# Altium schematic sheet Sheet_1_2026-02-17.schdoc
size 315 x 198 mm
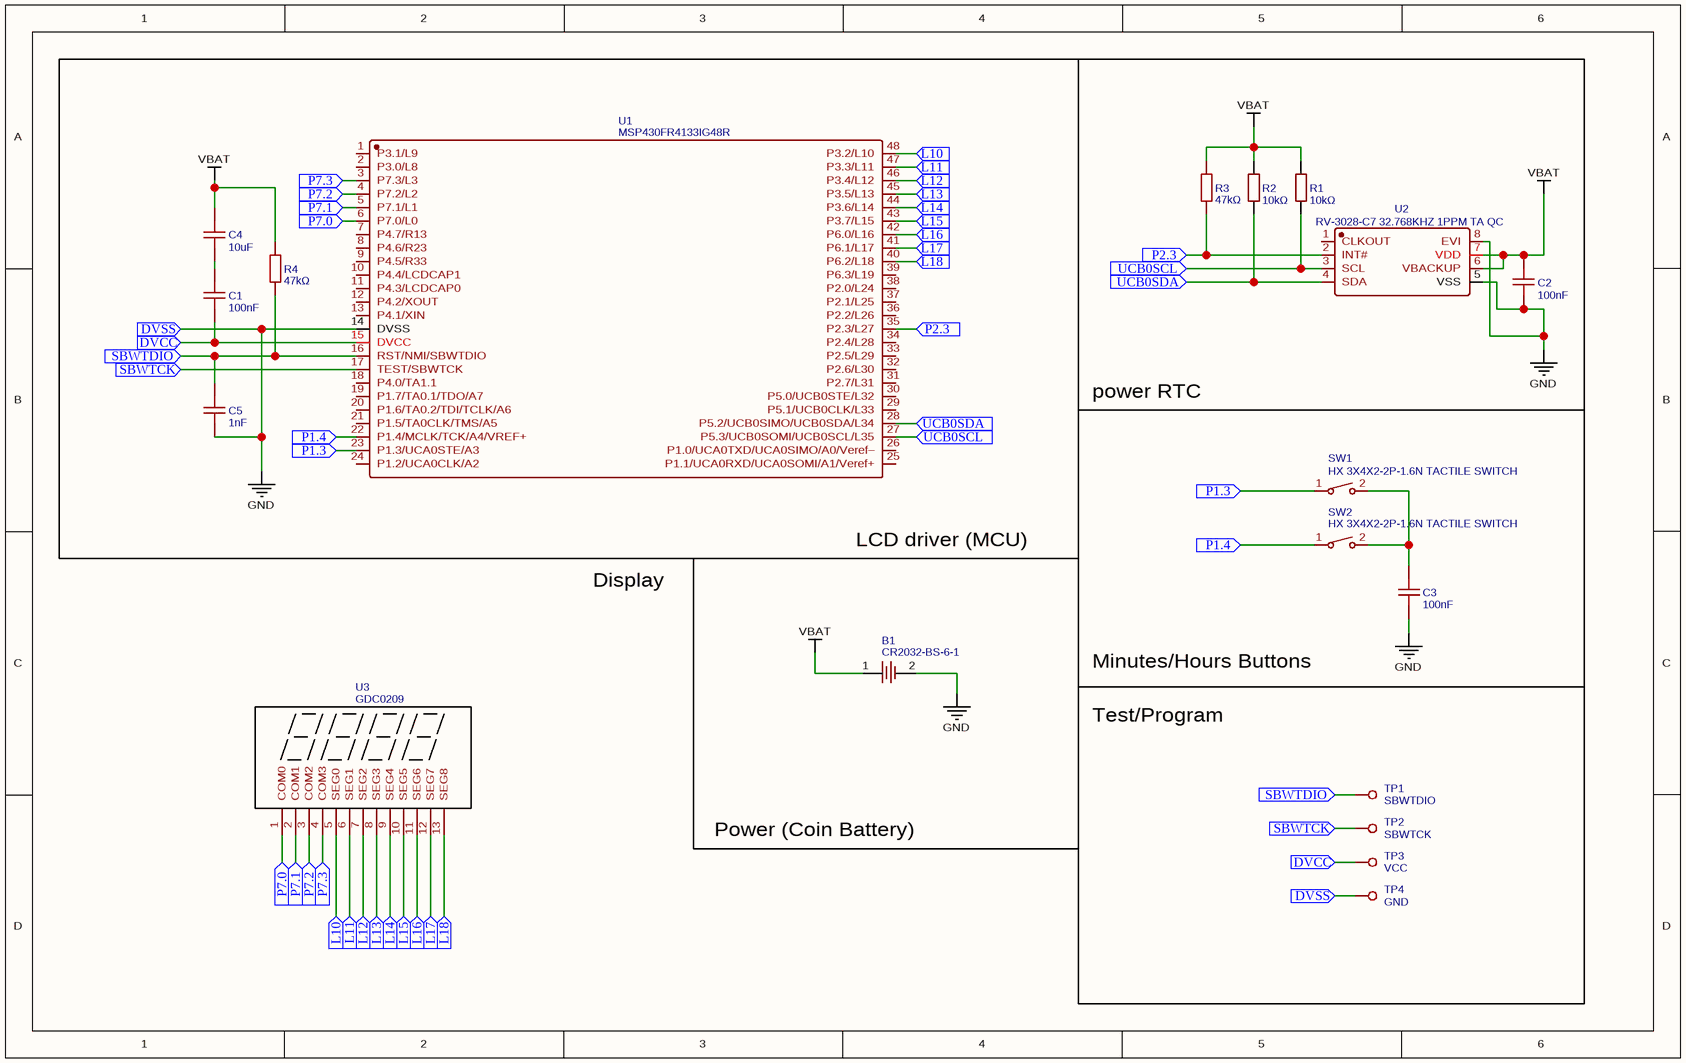
[diagram p0: Sheet_1_2026-02-17.schdoc]

## Parts
B1  CR2032-BS-6-1  [BAT-TH_CR2032-BS-6-1]
C1  100nF  [C0603]
C2  100nF  [C0603]
C3  100nF  [C0603]
C4  10uF  [C0805]
C5  1nF  [C0402]
R1  10kΩ  [R0603]
R2  10kΩ  [R0603]
R3  47kΩ  [R0603]
R4  47kΩ  [R0603]
SW1  HX 3X4X2-2P-1.6N TACTILE SWITCH  [KEY-SMD_L4.0-W3.0-LS4.9-1]
SW2  HX 3X4X2-2P-1.6N TACTILE SWITCH  [KEY-SMD_L4.0-W3.0-LS4.9-1]
TP1  SBWTDIO  [TESTPOINT:TESTPOINT_PAD_2.0X2.0MM]
TP2  SBWTCK  [TESTPOINT:TESTPOINT_PAD_2.0X2.0MM]
TP3  VCC  [TESTPOINT:TESTPOINT_PAD_2.0X2.0MM]
TP4  GND  [TESTPOINT:TESTPOINT_PAD_2.0X2.0MM]
U1  MSP430FR4133IG48R  [TSSOP-48_L12.5-W6.1-P0.50-LS8.1-BL]
U2  RV-3028-C7 32.768KHZ 1PPM TA QC  [OSC-SMD_8P-L3.2-W1.5-P0.90-BL]
U3  GDC0209  [GDC0209]

## Blocks framed on the sheet
LCD driver (MCU): C1 C4 C5 R4 U1
power RTC: C2 R1-R3 U2

## Ports
DVCC (in), DVSS (in), L10 (in), L11 (in), L12 (in), L13 (in), L14 (in), L15 (in), L16 (in), L17 (in), L18 (in), P1.3 (in), P1.4 (in), P2.3 (in), P7.0 (in), P7.1 (in), P7.2 (in), P7.3 (in), SBWTCK (in), SBWTDIO (in), UCB0SCL (in), UCB0SDA (in)

## Nets
GND: B1.2 C2.2 C3.2 C5.2 TP4.1 U1.14(DVSS) U2.5(VSS) U2.8(EVI) ; port DVSS
VBAT: B1.1 C2.1 C4.2 R1.1 R2.1 R3.1 R4.1 U2.6(VBACKUP) U2.7(VDD)
DVCC: C1.2 TP3.1 U1.15(DVCC) ; port DVCC
L10: U1.48(P3.2/L10) U3.5(SEG0) ; port L10
L11: U1.47(P3.3/L11) U3.6(SEG1) ; port L11
L12: U1.46(P3.4/L12) U3.7(SEG2) ; port L12
L13: U1.45(P3.5/L13) U3.8(SEG3) ; port L13
L14: U1.44(P3.6/L14) U3.9(SEG4) ; port L14
L15: U1.43(P3.7/L15) U3.10(SEG5) ; port L15
L16: U1.42(P6.0/L16) U3.11(SEG6) ; port L16
L17: U1.41(P6.1/L17) U3.12(SEG7) ; port L17
L18: U1.40(P6.2/L18) U3.13(SEG8) ; port L18
P1.3: SW1.1 U1.23(P1.3/UCA0STE/A3) ; port P1.3
P1.4: SW2.1 U1.22(P1.4/MCLK/TCK/A4/VREF+) ; port P1.4
P2.3: R3.2 U1.35(P2.3/L27) U2.2(INT#) ; port P2.3
P7.0: U1.6(P7.0/L0) U3.1(COM0) ; port P7.0
P7.1: U1.5(P7.1/L1) U3.2(COM1) ; port P7.1
P7.2: U1.4(P7.2/L2) U3.3(COM2) ; port P7.2
P7.3: U1.3(P7.3/L3) U3.4(COM3) ; port P7.3
SBWTCK: TP2.1 U1.17(TEST/SBWTCK) ; port SBWTCK
SBWTDIO: C5.1 R4.2 TP1.1 U1.16(RST/NMI/SBWTDIO) ; port SBWTDIO
UCB0SCL: R1.2 U1.27(P5.3/UCB0SOMI/UCB0SCL/L35) U2.3(SCL) ; port UCB0SCL
UCB0SDA: R2.2 U1.28(P5.2/UCB0SIMO/UCB0SDA/L34) U2.4(SDA) ; port UCB0SDA
NetC1_1: C1.1 C4.1
NetC3_1: C3.1 SW1.2 SW2.2

Not connected (* = marked no-connect by the designer): U1 1(P3.1/L9) 2(P3.0/L8) 7(P4.7/R13) 8(P4.6/R23) 9(P4.5/R33) 10(P4.4/LCDCAP1) 11(P4.3/LCDCAP0) 12(P4.2/XOUT) 13(P4.1/XIN) 18(P4.0/TA1.1) 19(P1.7/TA0.1/TDO/A7) 20(P1.6/TA0.2/TDI/TCLK/A6) 21(P1.5/TA0CLK/TMS/A5) 24(P1.2/UCA0CLK/A2) 25(P1.1/UCA0RXD/UCA0SOMI/A1/Veref+) 26(P1.0/UCA0TXD/UCA0SIMO/A0/Veref–) 29(P5.1/UCB0CLK/L33) 30(P5.0/UCB0STE/L32) 31(P2.7/L31) 32(P2.6/L30) 33(P2.5/L29) 34(P2.4/L28) 36(P2.2/L26) 37(P2.1/L25) 38(P2.0/L24) 39(P6.3/L19); U2 1(CLKOUT)

## Notes on the sheet
- Display
- Minutes/Hours Buttons
- Test/Program
- Power (Coin Battery)

## Library data of the parts
B1 = CR2032-BS-6-1: Manufacturer: Q&J; Supplier: LCSC; Manufacturer Part: CR2032-BS-6-1; Supplier Part: C70377; JLCPCB Part Class: Extended Part; spicePre: B; spiceSymbolName: CR2032-BS-6-1
C1-C3 = 100nF: Manufacturer: YAGEO(国巨); Manufacturer Part: CC0603KRX7R9BB104; nameAlias: Value; Supplier: LCSC; Supplier Part: C14663; JLCPCB Part Class: Basic Part; spicePre: C; spiceSymbolName: CC0603KRX7R9BB104
C4 = 10uF: Manufacturer: CCTC(三环); Manufacturer Part: TCC0805X5R106M160FTN; nameAlias: Value; Contributor: lcsc; Supplier: LCSC; Supplier Part: C18185773; JLCPCB Part Class: Extended Part; spicePre: C; spiceSymbolName: TCC0805X5R106M160FTN
C5 = 1nF: Manufacturer: KYOCERA AVX; Manufacturer Part: 04025C102KAT2A; nameAlias: Value; Contributor: Alexandre De Serres; Voltage: 50V; Tolerance: 10%; Supplier: Digi-Key; Supplier Part: 478-1101-1-ND; link: https://www.digikey.ca/en/products/detail/kyocera-avx/04025C102KAT2A/563211; spicePre: C; spiceSymbolName: 04025C102KAT2A
R1 R2 = 10kΩ: Manufacturer: UNI-ROYAL(厚声); Manufacturer Part: 0603WAF1002T5E; nameAlias: Value; Supplier: LCSC; Supplier Part: C25804; JLCPCB Part Class: Basic Part; spicePre: R; spiceSymbolName: 0603WAF1002T5E
R3 R4 = 47kΩ: Manufacturer: Tyohm(幸亚电阻); Manufacturer Part: RMC060347K5%N; nameAlias: Value; Contributor: LCSC; Supplier: LCSC; Supplier Part: C269695; JLCPCB Part Class: Extended Part; spicePre: R; spiceSymbolName: RMC060347K5%N
SW1 SW2 = HX 3X4X2-2P-1.6N TACTILE SWITCH: Manufacturer: hanxia(韩下); Contributor: lcsc; Supplier: LCSC; Supplier Part: C49234124; Manufacturer Part: HX 3x4x2-2P-1.6N TACTILE SWITCH; JLCPCB Part Class: Extended Part; spicePre: S; spiceSymbolName: HX 3X4X2-2P-1.6N TACTILE SWITCH
TP1 = SBWTDIO: Symbol: Connector_TestPoint; Users: REF**; field4: nf; sheetfile: PCIe.kicad_sch; sheetname: PCIe-connector; Add into BOM: yes; Contributor: Steve Forest; Device: Connector_TestPoint; field5: nf; field6: nf; field7: nf; Convert to PCB: yes; Origin Footprint: TestPoint:TestPoint_Pad_2.0x2.0mm; Field4: nf; Field5: nf; Field6: nf; Field7: nf; spicePre: T; spiceSymbolName: CONNECTOR_TESTPOINT_2*2MM
TP2 = SBWTCK: Symbol: Connector_TestPoint; Users: REF**; field4: nf; sheetfile: PCIe.kicad_sch; sheetname: PCIe-connector; Add into BOM: yes; Contributor: Steve Forest; Device: Connector_TestPoint; field5: nf; field6: nf; field7: nf; Convert to PCB: yes; Origin Footprint: TestPoint:TestPoint_Pad_2.0x2.0mm; Field4: nf; Field5: nf; Field6: nf; Field7: nf; spicePre: T; spiceSymbolName: CONNECTOR_TESTPOINT_2*2MM
TP3 = VCC: Symbol: Connector_TestPoint; Users: REF**; field4: nf; sheetfile: PCIe.kicad_sch; sheetname: PCIe-connector; Add into BOM: yes; Contributor: Steve Forest; Device: Connector_TestPoint; field5: nf; field6: nf; field7: nf; Convert to PCB: yes; Origin Footprint: TestPoint:TestPoint_Pad_2.0x2.0mm; Field4: nf; Field5: nf; Field6: nf; Field7: nf; spicePre: T; spiceSymbolName: CONNECTOR_TESTPOINT_2*2MM
TP4 = GND: Symbol: Connector_TestPoint; Users: REF**; field4: nf; sheetfile: PCIe.kicad_sch; sheetname: PCIe-connector; Add into BOM: yes; Contributor: Steve Forest; Device: Connector_TestPoint; field5: nf; field6: nf; field7: nf; Convert to PCB: yes; Origin Footprint: TestPoint:TestPoint_Pad_2.0x2.0mm; Field4: nf; Field5: nf; Field6: nf; Field7: nf; spicePre: T; spiceSymbolName: CONNECTOR_TESTPOINT_2*2MM
U1 = MSP430FR4133IG48R: Manufacturer: TI(德州仪器); Contributor: lcsc; Supplier: LCSC; Supplier Part: C2053877; Manufacturer Part: MSP430FR4133IG48R; JLCPCB Part Class: Extended Part; spicePre: U; spiceSymbolName: MSP430FR4133IG48R
U2 = RV-3028-C7 32.768KHZ 1PPM TA QC: Manufacturer: Micro Crystal(瑞士微晶); Contributor: lcsc; Supplier: LCSC; Supplier Part: C3019759; Manufacturer Part: RV-3028-C7 32.768kHz 1ppm TA QC; JLCPCB Part Class: Extended Part; spicePre: U; spiceSymbolName: RV-3028-C7 32.768KHZ 1PPM TA QC
U3 = GDC0209: Manufacturer: DALIAN GOOD DISPLAY CO., LTD.; Contributor: mskluchko; Manufacturer Part: GDC0209; Supplier Part: GDC0209; link: https://www.good-display.com/product/4-Digits-LCD-Panel,-GDC0209-314.html; spicePre: U; spiceSymbolName: GDC0209